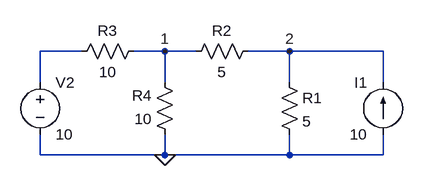
[diagram p0: schematic q1_circuit_4.asc]
q1_circuit_4.asc, the LTspice schematic file:
Version 4
SHEET 1 880 680
WIRE -32 -128 -96 -128
WIRE 96 -128 48 -128
WIRE 144 -128 96 -128
WIRE 288 -128 224 -128
WIRE 432 -128 288 -128
WIRE -96 -80 -96 -128
WIRE 96 -80 96 -128
WIRE 288 -80 288 -128
WIRE 432 -80 432 -128
WIRE -96 32 -96 0
WIRE 96 32 96 0
WIRE 96 32 -96 32
WIRE 288 32 288 0
WIRE 288 32 96 32
WIRE 432 32 432 0
WIRE 432 32 288 32
FLAG 96 32 0
FLAG 96 -128 1
FLAG 288 -128 2
SYMBOL voltage -96 -96 R0
SYMATTR InstName V2
SYMATTR Value 10
SYMBOL res 64 -144 R90
WINDOW 0 0 56 VBottom 2
WINDOW 3 32 56 VTop 2
SYMATTR InstName R3
SYMATTR Value 10
SYMBOL res 112 16 R180
WINDOW 0 36 76 Left 2
WINDOW 3 36 40 Left 2
SYMATTR InstName R4
SYMATTR Value 10
SYMBOL current 432 0 R180
WINDOW 0 24 80 Left 2
WINDOW 3 24 0 Left 2
SYMATTR InstName I1
SYMATTR Value 10
SYMBOL res 272 -96 R0
SYMATTR InstName R1
SYMATTR Value 5
SYMBOL res 240 -144 R90
WINDOW 0 0 56 VBottom 2
WINDOW 3 32 56 VTop 2
SYMATTR InstName R2
SYMATTR Value 5

The netlist it stands for:
* q1_circuit_4.asc
V2 N001 0 10
R3 1 N001 10
R4 0 1 10
I1 0 2 10
R1 2 0 5
R2 2 1 5
.backanno
.end